# EAGLE design EspBreakoutBoard (EAGLE 6.1)
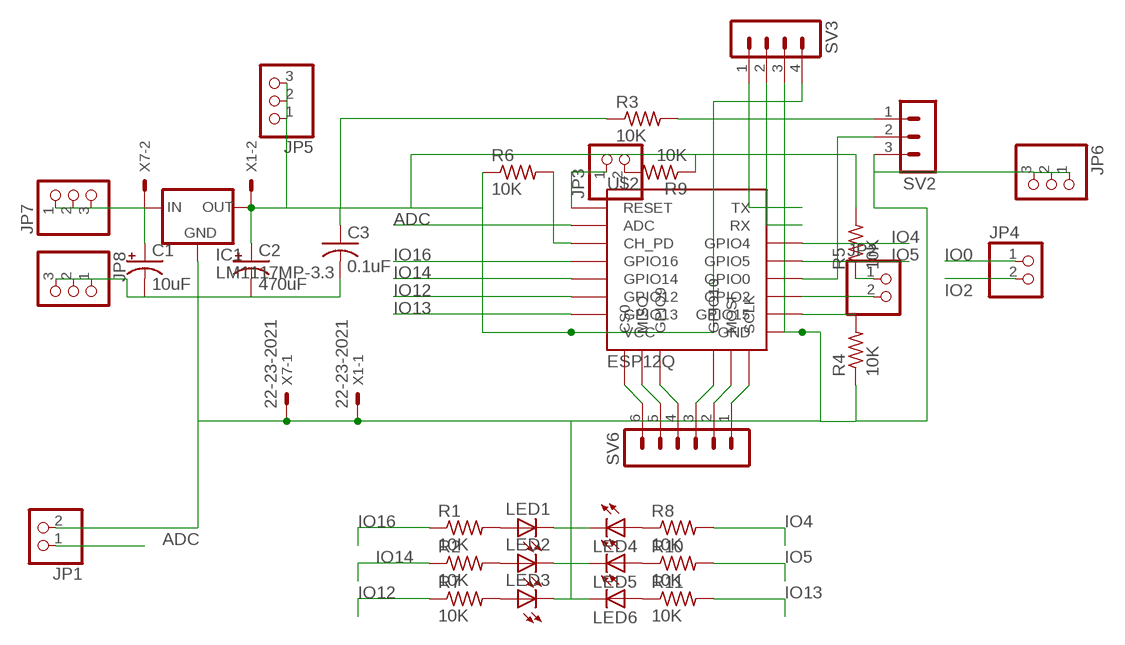
[diagram p0: schematic, sheet 1]

## Parts
C1  10uF  CPOL-USE2.5-6  [E2,5-6]
C2  470uF  CPOL-USE5-8.5  [E5-8,5]
C3  0.1uF  C-US025-040X050  [C025-040X050]
IC1  LM1117MP-3.3  [SOT223]
JP1  PINHD-1X2  [1X02]
JP2  PINHD-1X2  [1X02]
JP3  PINHD-1X2  [1X02]
JP4  PINHD-1X2  [1X02]
JP5  PINHD-1X3  [1X03]
JP6  PINHD-1X3  [1X03]
JP7  PINHD-1X3  [1X03]
JP8  PINHD-1X3  [1X03]
LED1  LED3MM  [LED3MM]
LED2  LED3MM  [LED3MM]
LED3  LED3MM  [LED3MM]
LED4  LED3MM  [LED3MM]
LED5  LED3MM  [LED3MM]
LED6  LED3MM  [LED3MM]
R1  10K  R-US_0207/10  [0207/10]
R2  10K  R-US_0207/10  [0207/10]
R3  10K  R-US_0207/10  [0207/10]
R4  10K  R-US_0207/10  [0207/10]
R5  10K  R-US_0207/10  [0207/10]
R6  10K  R-US_0207/10  [0207/10]
R7  10K  R-US_0207/10  [0207/10]
R8  10K  R-US_0207/10  [0207/10]
R9  10K  R-US_0207/10  [0207/10]
R10  10K  R-US_0207/10  [0207/10]
R11  10K  R-US_0207/10  [0207/10]
SV2  MA03-1  [MA03-1]
SV3  MA04-1  [MA04-1]
SV6  MA06-1  [MA06-1]
U$2  ESP12Q  [ESP12Q]
X1  22-23-2021  [22-23-2021]
X7  22-23-2021  [22-23-2021]

## Nets
5V1: C1.+ IC1.3(IN) JP7.1 JP7.2 JP7.3 X7.2
ADC: JP1.1 U$2.ADC
GND: C1.- C2.- C3.2 IC1.1(GND) JP1.2 JP6.1 JP6.2 JP6.3 JP8.1 JP8.2 JP8.3 LED1.K(C) LED2.K(C) LED3.K(C) LED4.K(C) LED5.K(C) LED6.K(C) R4.1 SV2.3 SV3.3 U$2.GND X1.1 X7.1
IO0: JP4.1 SV2.2 U$2.GPIO0
IO2: JP2.2 JP4.2 U$2.GPIO2
IO4: R8.2 U$2.GPIO4
IO5: R10.2 U$2.GPIO5
IO12: R7.1 U$2.GPIO12
IO13: R11.2 U$2.GPIO13
IO14: R2.1 U$2.GPIO14
IO16: R1.1 U$2.GPIO16
N$1: JP2.1 R5.1
N$2: JP3.2 R9.2
N$5: JP3.1 U$2.RESET
N$7: R3.2 SV2.1
N$10: R4.2 U$2.GPIO15
N$11: SV3.1 U$2.TX
N$14: SV3.2 U$2.RX
N$16: R6.2 U$2.CH_PD
N$17: C2.+ C3.1 IC1.2(OUT) IC1.4(OUT) JP5.1 JP5.2 JP5.3 R3.1 R5.2 R6.1 R9.1 SV3.4 U$2.VCC X1.2
N$18: LED1.A R1.2
N$20: LED2.A R2.2
N$21: LED3.A R7.2
N$22: LED4.A R8.1
N$23: LED5.A R10.1
N$24: LED6.A R11.1
N$26: SV6.1 U$2.SCLK
N$27: SV6.4 U$2.GPIO9
N$28: SV6.5 U$2.MISO
N$29: SV6.6 U$2.CS0
N$30: SV6.2 U$2.MOSI
N$31: SV6.3 U$2.GPIO10

## Library data of the parts
C1 C2 = rcl:CPOL-US: POLARIZED CAPACITOR, American symbol
C3 = resistor:C-US: CAPACITOR, American symbol
IC1 = lm1117_10:LM1117?-*: 800mA Low-Dropout Linear Regulator Source: http://www.ti.com/lit/ds/symlink/lm1117-n.pdf; MF: Texas Instruments; MPN: LM1117MP-3.3; OC_FARNELL: 9778195; OC_NEWARK: 28X3416
JP1-JP4 = pinhead:PINHD-1X2: PIN HEADER
JP5-JP8 = pinhead:PINHD-1X3: PIN HEADER
LED1-LED6 = led:LED: LED OSRAM: - CHIPLED LG R971, LG N971, LY N971, LG Q971, LY Q971, LO R971, LY R971 LH N974, LH R974 LS Q976, LO Q976, LY Q976 LO Q996 - Hyper CHIPLED LW Q18S LB Q993, LB Q99A, LB R99A - SideLED LS A670, LO A670, LY A670, LG A670, LP A670 LB A673, LV A673, LT A673, LW A673 LH A674 LY A675 LS A676, LA A676, LO A676, LY A676, LW A676 LS A679, LY A679, LG A679 - Hyper Micro SIDELED® LS Y876, LA Y876, LO Y876, LY Y876 LT Y87S - SmartLED LW L88C, LW L88S LB L89C, LB L89S, LG L890 LS L89K, LO L89K, LY L89K LS L896, LA L896, LO L896, LY L896 - TOPLED LS T670, LO T670, LY T670, LG T670, LP T670 LSG T670, LSP T670, LSY T670, LOP T670, LYG T670 LG T671, LOG T671, LSG T671 LB T673, LV T673, LT T673, LW T673 LH T674 LS T676, LA T676, LO T676, LY T676, LB T676, LH T676, LSB T676, LW T676 LB T67C, LV T67C, LT T67C, LS T67K, LO T67K, LY T67K, LW E67C LS E67B, LA E67B, LO E67B, LY E67B, LB E67C, LV E67C, LT E67C LW T67C LS T679, LY T679, LG T679 LS T770, LO T770, LY T770, LG T770, LP T770 LB T773, LV T773, LT T773, LW T773 LH T774 LS E675, LA E675, LY E675, LS T675 LS T776, LA T776, LO T776, LY T776, LB T776 LHGB T686 LT T68C, LB T68C - Hyper Mini TOPLED® LB M676 - Mini TOPLED Santana® LG M470 LS M47K, LO M47K, LY M47K Source: http://www.osram.convergy.de LUXEON: - LUMILED® LXK2-PW12-R00, LXK2-PW12-S00, LXK2-PW14-U00, LXK2-PW14-V00 LXK2-PM12-R00, LXK2-PM12-S00, LXK2-PM14-U00 LXK2-PE12-Q00, LXK2-PE12-R00, LXK2-PE12-S00, LXK2-PE14-T00, LXK2-PE14-U00 LXK2-PB12-K00, LXK2-PB12-L00, LXK2-PB12-M00, LXK2-PB14-N00, LXK2-PB14-P00, LXK2-PB14-Q00 LXK2-PR12-L00, LXK2-PR12-M00, LXK2-PR14-Q00, LXK2-PR14-R00 LXK2-PD12-Q00, LXK2-PD12-R00, LXK2-PD12-S00 LXK2-PH12-R00, LXK2-PH12-S00 LXK2-PL12-P00, LXK2-PL12-Q00, LXK2-PL12-R00 Source: www.luxeon.com KINGBRIGHT: KA-3528ASYC Source: www.kingbright.com
R1-R11 = rcl:R-US_: RESISTOR, American symbol
SV2 = con-lstb:MA03-1: PIN HEADER; OC_FARNELL: unknown; OC_NEWARK: unknown
SV3 = con-lstb:MA04-1: PIN HEADER; OC_FARNELL: unknown; OC_NEWARK: unknown
SV6 = con-lstb:MA06-1: PIN HEADER; OC_FARNELL: unknown; OC_NEWARK: unknown
U$2 = esp826612q:ESP12Q: ESP8266 Wifi module 12-Q
X1 X7 = con-molex:22-23-2021: .100" (2.54mm) Center Header - 2 Pin; MF: MOLEX; MPN: 22-23-2021; OC_FARNELL: 1462926; OC_NEWARK: 25C3832

## Board
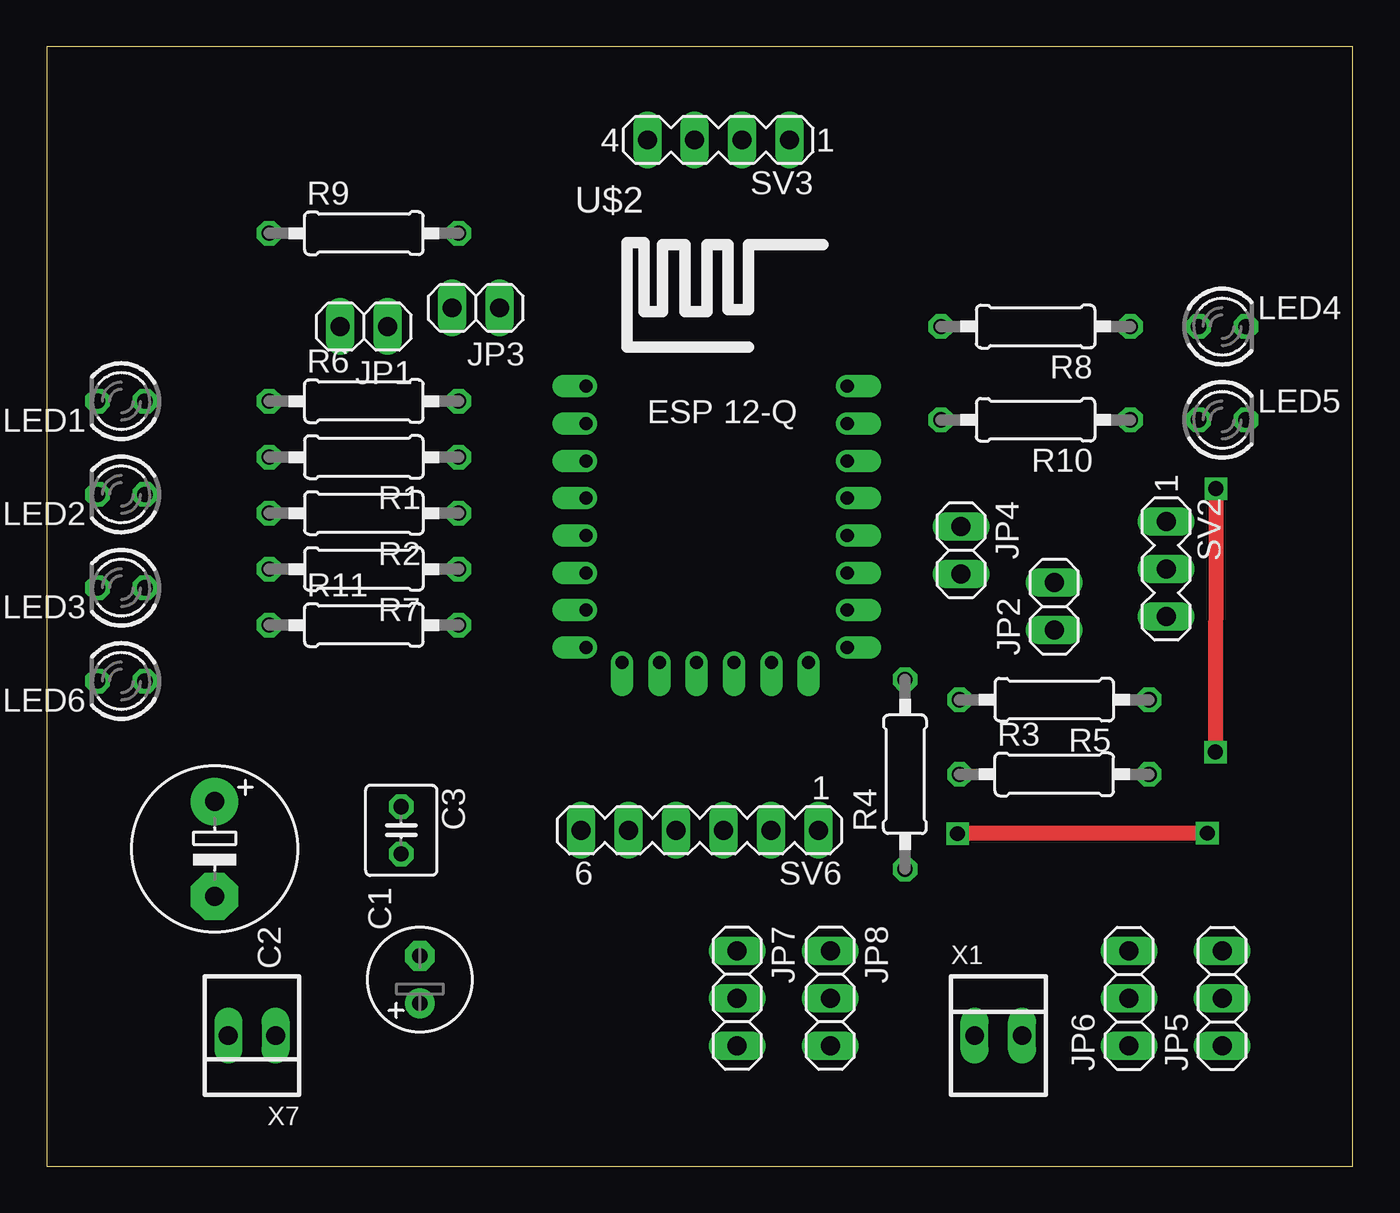
[diagram p1: board, top side]
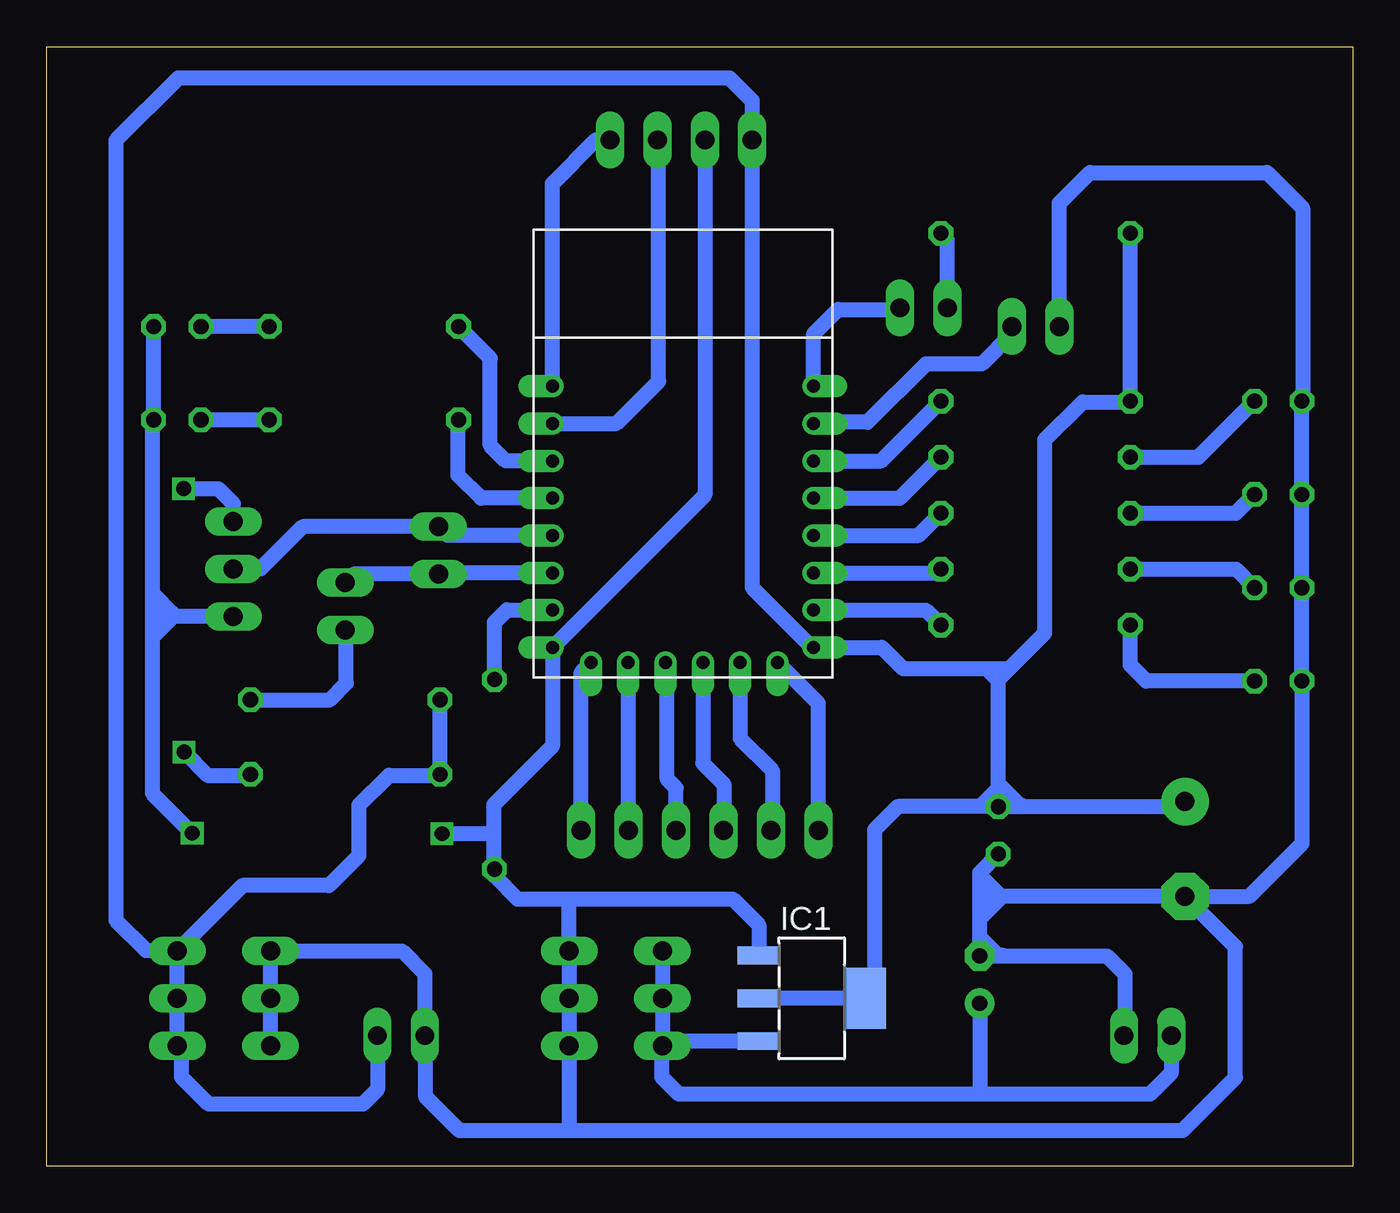
[diagram p2: board, bottom side, seen from below]

Size 70 x 60 mm. Coordinates in mm from the lower left corner, seen from the top.
Outline: 70,0 70,60 0,60 0,0 70,0
Copper layers (1*16): Top 0.035mm / dielectric 1.5mm / Bottom 0.035mm
Design rules: minimum track width 10mil, minimum drill 24mil, track to track 8mil, track to pad 8mil, pad to pad 8mil, via to via 8mil, smd to smd 8mil, copper to edge 40mil, drill to drill 8mil, minimum pad ring 10mil, minimum via ring 8mil, stop-mask expansion 4mil, vias tented up to drill 0mil, thermal gap 10mil

### Footprints (pad centres in the part's own frame; a part is rotated, then mirrored left to right if it is on the bottom)
E2,5-6 = drill 0.813 pad 1.6: + -1.27,0 | drill 0.813 pad 1.6 octagon: - 1.27,0
E5-8,5 = drill 1.016 pad 2.54: + -2.54,0 | drill 1.016 pad 2.54 octagon: - 2.54,0
C025-040X050 = drill 0.813 octagon: 1 -1.27,0; 2 1.27,0
SOT223 = smd 0.95 x 2.15: 1 -2.3,-2.9; 2 0,-2.9; 3 2.3,-2.9 | smd 3.25 x 2.15: 4 0,2.9
1X02 = drill 1.016 long: 1 -1.27,0; 2 1.27,0
1X03 = drill 1.016 long: 1 -2.54,0; 2 0,0; 3 2.54,0
LED3MM = drill 0.813 octagon: A -1.27,0; K 1.27,0
0207/10 = drill 0.813 octagon: 1 -5.08,0; 2 5.08,0
MA03-1 = drill 1.016 long: 1 -2.54,0; 2 0,0; 3 2.54,0
MA04-1 = drill 1.016 long: 1 -3.81,0; 2 -1.27,0; 3 1.27,0; 4 3.81,0
MA06-1 = drill 1.016 long: 1 -6.35,0; 2 -3.81,0; 3 -1.27,0; 4 1.27,0; 5 3.81,0; 6 6.35,0
ESP12Q = drill 0.7 offset: ADC -7.1,3.8; CH_PD -7.1,1.8; CS0 -5.165,-9.005; GND 6.9,-8.2; GPIO0 6.9,-2.2; GPIO2 6.9,-4.2; GPIO4 6.9,1.8; GPIO5 6.9,-0.2; GPIO9 -1.165,-9.005; GPIO10 0.835,-9.005; GPIO12 -7.1,-4.2; GPIO13 -7.1,-6.2; GPIO14 -7.1,-2.2; GPIO15 6.9,-6.2; GPIO16 -7.1,-0.2; MISO -3.165,-9.005; MOSI 2.835,-9.005; RESET -7.1,5.8; RX 6.9,3.8; SCLK 4.835,-9.005; TX 6.9,5.8; VCC -7.1,-8.2
22-23-2021 = drill 1 long: 1 -1.27,0; 2 1.27,0

### Placement (x,y rotation side)
C1  20,10 90 top
C2  9,17 270 top
C3  19,18 270 top
IC1  29,9 270 bottom
JP1  17,45 180 top
JP2  54,30 90 top
JP3  23,46 180 top
JP4  49,33 270 top
JP5  63,9 90 top
JP6  58,9 90 top
JP7  37,9 270 top
JP8  42,9 270 top
LED1  4,41 180 top
LED2  4,36 180 top
LED3  4,31 180 top
LED4  63,45 0 top
LED5  63,40 0 top
LED6  4,26 180 top
R1  17,38 180 top
R2  17,35 180 top
R3  54,21 0 top
R4  46,21 90 top
R5  54,25 180 top
R6  17,41 0 top
R7  17,32 180 top
R8  53,45 180 top
R9  17,50 0 top
R10  53,40 180 top
R11  17,29 0 top
SV2  60,32 270 top
SV3  36,55 180 top
SV6  35,18 180 top
U$2  36,36 0 top
X1  51,7 0 top
X7  11,7 180 top

### Tracks (layer width: path | path; a pad name or v marks a point on that pad's centre or on a via)
5V1
  Bottom 0.813: 20.08,8.81 C1.+ 20,3.97 19.89,3.86 | JP7.1 JP7.2 JP7.3 | IC1.3 36.76,6.7 JP7.3 | X7.2 9.73,5 10.87,3.86 19.89,3.86 | 19.89,3.86 36.12,3.86 37.03,4.78 37.03,6.43 JP7.3
ADC
  Bottom 0.813: JP1.1 18.27,44.61 19.89,42.99 22.88,42.99 26.01,39.87 28.83,39.87 U$2.ADC
GND  (via drill 0.8)
  Top 0.813: v62.2,17.85 48.84,17.85 v48.81,17.82
  Bottom 0.813: 46.05,18 46.05,19.37 42.9,22.52 U$2.GND 34.73,35.97 SV3.3 | 46.05,18 46.05,15.97 R4.1 46,15.54 44.78,14.33 41.81,14.33 | JP1.2 15.73,51.62 14.09,53.26 4.59,53.26 2.69,51.35 2.69,41.04 LED1.K LED2.K LED3.K LED6.K 2.73,17.27 5.54,14.46 C2.- | X7.1 12.21,7.06 12.21,10.3 13.18,11.27 C1.- 20,14.37 | 20,14.37 20,15.73 C3.2 | C2.- 19.91,14.46 20,14.37 | 42.06,1.92 47.9,1.92 49.68,3.71 49.68,6.95 X1.1 49.73,10.31 50.96,11.54 JP6.3 JP6.2 JP6.1 | 42.06,1.92 9.12,1.92 6.3,4.74 6.3,11.76 C2.- | SV2.3 64.31,29.46 64.33,29.48 | LED4.K LED5.K 64.33,39.94 64.33,29.48 | 64.33,29.48 64.33,28.34 | 64.33,28.34 64.33,19.98 v62.2,17.85 | v48.81,17.82 46.27,17.82 46.23,17.87 46.17,17.87 46.05,18 | 64.33,28.34 63.27,29.41 63.27,29.66 64.21,30.6 | 42.06,1.92 42,1.99 JP8.3 JP8.2 JP8.1 42,14.13 41.81,14.33 | 41.81,14.33 33.22,14.33 31.83,12.93 31.83,11.35 | 31.83,11.35 31.8,11.33 | 31.83,11.35 31.85,11.35 IC1.1
IO0
  Bottom 0.813: U$2.GPIO0 48.53,33.8 JP4.1 56.27,34.27 58.52,32.02 59.98,32.02 SV2.2
IO2
  Bottom 0.813: U$2.GPIO2 48.93,31.8 JP4.2 53.54,31.73 JP2.2
IO4
  Bottom 0.813: U$2.GPIO4 45.4,37.8 46.23,38.62 46.23,43.3 R8.2
IO5
  Bottom 0.813: U$2.GPIO5 46.73,35.8 47.95,37.02 47.95,39.97 R10.2
IO12
  Bottom 0.813: U$2.GPIO12 22.28,31.8 R7.1
IO13
  Bottom 0.813: U$2.GPIO13 22.88,29.8 R11.2
IO14
  Bottom 0.813: U$2.GPIO14 23.28,33.8 R2.1
IO16
  Bottom 0.813: U$2.GPIO16 24.28,35.8 R1.1
N$1
  Bottom 0.813: R5.1 54.82,25 53.95,25.88 53.95,28.68 JP2.1
N$2
  Bottom 0.813: JP3.2 21.73,49.65 R9.2
N$3
  Bottom 0.813: 17.7,19.32 17.83,19.32 18.89,20.39 18.89,20.36 19.91,19.35
N$4
  Bottom 0.813: 18.18,26.86 18.21,26.86 19,26.08 19.05,26.08 19.48,26.51
N$5
  Bottom 0.813: U$2.RESET 28.9,44.6 27.58,45.91 24.36,45.91 JP3.1
N$6
  Bottom 0.813: 18.69,11.29 19.02,11.29 19.89,12.16
N$7  (via drill 0.8)
  Top 0.813: v62.66,36.31 v62.63,22.19
  Bottom 0.813: v62.63,22.19 61.39,20.95 59.13,20.95 R3.2 | v62.66,36.31 60.8,36.31 59.99,35.5 60,35.49 SV2.1
N$8
  Bottom 0.813: 18.87,14.49 18.87,14.39 19.94,13.33
N$9
  Bottom 0.813: 18.82,14.47 18.87,14.47 19.81,15.41
N$10
  Bottom 0.813: R4.2 46,29.15 45.34,29.81 42.91,29.81 U$2.GPIO15
N$11
  Bottom 0.813: U$2.TX 42.9,52.67 40.56,55.01 SV3.1
N$14
  Bottom 0.813: U$2.RX 39.46,39.8 37.21,42.05 37.21,54.94 SV3.2
N$16
  Bottom 0.813: U$2.CH_PD 25.28,37.8 R6.2
N$17
  Bottom 0.813: 18.92,26.66 24.1,26.66 25.24,27.8 U$2.VCC 28.93,27.8 28.95,27.78 32.19,31.02 SV3.4 32.19,57.1 33.4,58.31 62.96,58.31 66.29,54.98 66.29,13.18 64.67,11.56 63.02,11.56 JP5.3 | 18.92,26.66 18.41,26.66 16.51,28.57 16.51,38.93 14.47,40.96 11.96,40.96 R6.1 R9.1 | C3.1 19,26.58 18.92,26.66 | C3.1 9.27,19.27 C2.+ | R5.2 R3.1 48.97,20.95 51.66,20.95 53.27,19.34 53.27,16.63 54.86,15.04 59.5,15.04 JP5.3 | C3.1 24.39,19.27 25.63,18.03 25.63,9.5 26.1,9.03 IC1.4 IC1.2 | X1.2 52.27,4.12 53.06,3.33 61.32,3.33 62.76,4.78 62.76,6.22 JP5.1 JP5.2 JP5.3
N$18
  Bottom 0.813: R1.2 8.27,38 LED1.A
N$20
  Bottom 0.813: R2.2 6.27,35 LED2.A
N$21
  Bottom 0.813: R7.2 6.27,32 LED3.A
N$22
  Bottom 0.813: R8.1 LED4.A
N$23
  Bottom 0.813: R10.1 LED5.A
N$24
  Bottom 0.813: LED6.A 11.07,26 11.94,26.86 11.94,28.98 R11.1
N$26
  Bottom 0.813: SV6.1 41.35,26.48 U$2.SCLK
N$27
  Bottom 0.813: U$2.GPIO9 34.84,21.6 33.7,20.46 33.7,18.03 SV6.4
N$28
  Bottom 0.813: U$2.MISO 32.84,22.92 31.11,21.2 31.11,18.08 SV6.5
N$29
  Bottom 0.813: SV6.6 28.65,24.81 U$2.CS0
N$30
  Bottom 0.813: U$2.MOSI 38.84,18.02 SV6.2
N$31
  Bottom 0.813: SV6.3 36.27,20.26 36.75,20.74 36.75,26.91 U$2.GPIO10